# Altium schematic sheet program.SchDoc
size A4
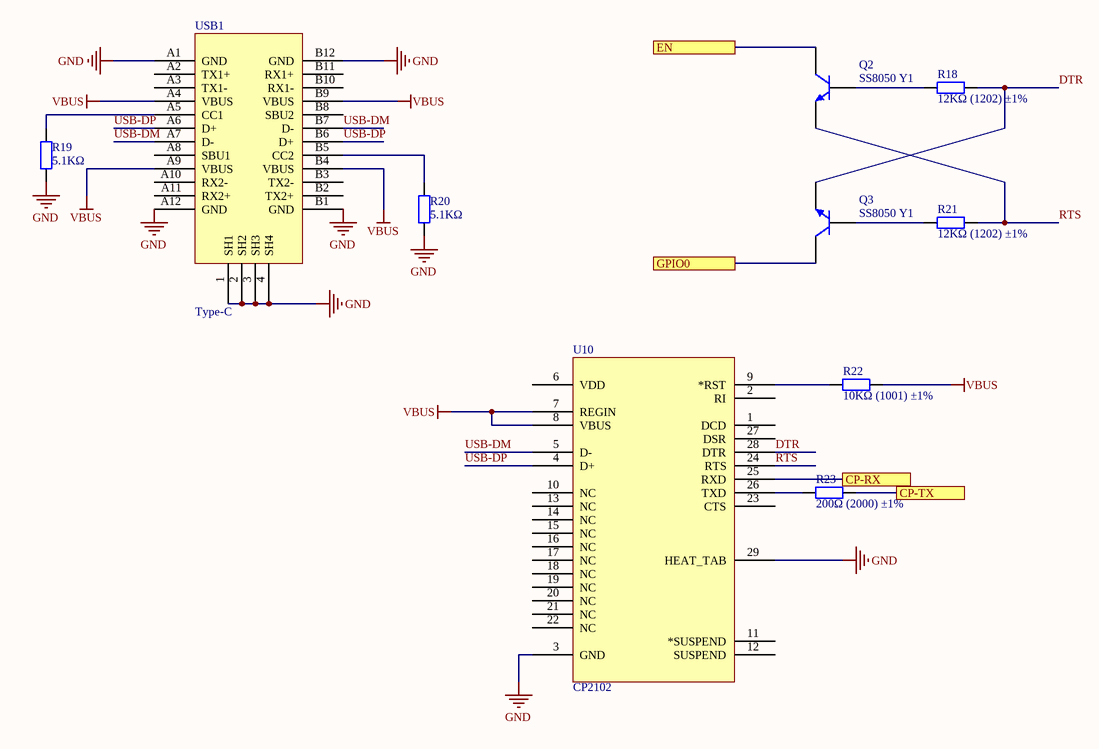
[diagram p0: program.SchDoc]

## Parts
Q2  SS8050 Y1  [SOT-23(SOT-23-3)]
Q3  SS8050 Y1  [SOT-23(SOT-23-3)]
R18  12KΩ (1202) ±1%  [0402_R]
R19  5.1KΩ  [0402_R]
R20  5.1KΩ  [0402_R]
R21  12KΩ (1202) ±1%  [0402_R]
R22  10KΩ (1001) ±1%  [0402_R]
R23  200Ω (2000) ±1%  [0402_R]
U10  CP2102  [QFN-28]
USB1  Type-C  [Type-C-TOP]

## Ports
CP-RX, CP-TX, EN, GPIO0

## Nets
GND: R19.1 R20.1 U10.3(GND) U10.29(HEAT_TAB) USB1.1(SH1) USB1.2(SH2) USB1.3(SH3) USB1.4(SH4) USB1.A1(GND) USB1.A12(GND) USB1.B1(GND) USB1.B12(GND)
VBUS: R22.2 U10.7(REGIN) U10.8(VBUS) USB1.A4(VBUS) USB1.A9(VBUS) USB1.B4(VBUS) USB1.B9(VBUS)
CP-RX: U10.25(RXD) ; port CP-RX
CP-TX: R23.2 ; port CP-TX
DTR: Q3.2(E) R18.2 U10.28(DTR)
EN: Q2.3(C) ; port EN
GPIO0: Q3.3(C) ; port GPIO0
RTS: Q2.2(E) R21.2 U10.24(RTS)
USB-DM: U10.5(D-) USB1.A7(D-) USB1.B7(D-)
USB-DP: U10.4(D+) USB1.A6(D+) USB1.B6(D+)
NetQ2_1: Q2.1(B) R18.1
NetQ3_1: Q3.1(B) R21.1
NetR19_2: R19.2 USB1.A5(CC1)
NetR20_2: R20.2 USB1.B5(CC2)
NetR22_1: R22.1 U10.9(*RST)
NetR23_1: R23.1 U10.26(TXD)

Not connected (* = marked no-connect by the designer): U10 1(DCD) 2(RI) 6(VDD) 10(NC) 11(*SUSPEND) 12(SUSPEND) 13(NC) 14(NC) 15(NC) 16(NC) 17(NC) 18(NC) 19(NC) 20(NC) 21(NC) 22(NC) 23(CTS) 27(DSR); USB1 A2(TX1+) A3(TX1-) A8(SBU1) A10(RX2-) A11(RX2+) B2(TX2+) B3(TX2-) B8(SBU2) B10(RX1-) B11(RX1+)

## Library data of the parts
Q2 Q3 = SOT-23 SS8050 Y1: 三极管; ComponentLink1Description: 供应商链接; ComponentLink1URL: http://www.szlcsc.com/product/details_2507.html; Package: SOT-23; Supplier: LC; SuppliersPartNumber: C2150
R18 R21 = 0402 12KΩ (1202) 1%: 贴片电阻; ComponentLink1Description: 供应商链接; ComponentLink1URL: http://www.szlcsc.com/product/details_26495.html; Package: 0402; Supplier: LC; SuppliersPartNumber: C25752
R19 R20 = 0402 5.1KΩ (5101) 1%: 贴片电阻; ComponentLink1Description: 供应商链接; ComponentLink1URL: http://www.szlcsc.com/product/details_26648.html; Package: 0402; Supplier: LC; SuppliersPartNumber: C25905
R22 = 0402 1KΩ (1001) 1%: 贴片电阻; ComponentLink1Description: 供应商链接; ComponentLink1URL: http://www.szlcsc.com/product/details_12256.html; Package: 0402; Supplier: LC; SuppliersPartNumber: C11702
R23 = 0402 200Ω (2000) 1%: 贴片电阻; ComponentLink1Description: 供应商链接; ComponentLink1URL: http://www.szlcsc.com/product/details_25830.html; Package: 0402; Supplier: LC; SuppliersPartNumber: C25087
U10 = CP2102: USB转TTL; PART DESC: SINGLE-CHIP USB TO UART BRIDGE, QFN28, RoHS.; MFG #1: SILICON LABS; PART NUMBER: CP2102; Value: Value; RefDes: RefDes; Type: DEV
USB1 = USB-Type-C-TOP